# EAGLE schematic SSS_SOB_REPRO (EAGLE 9.6.2)
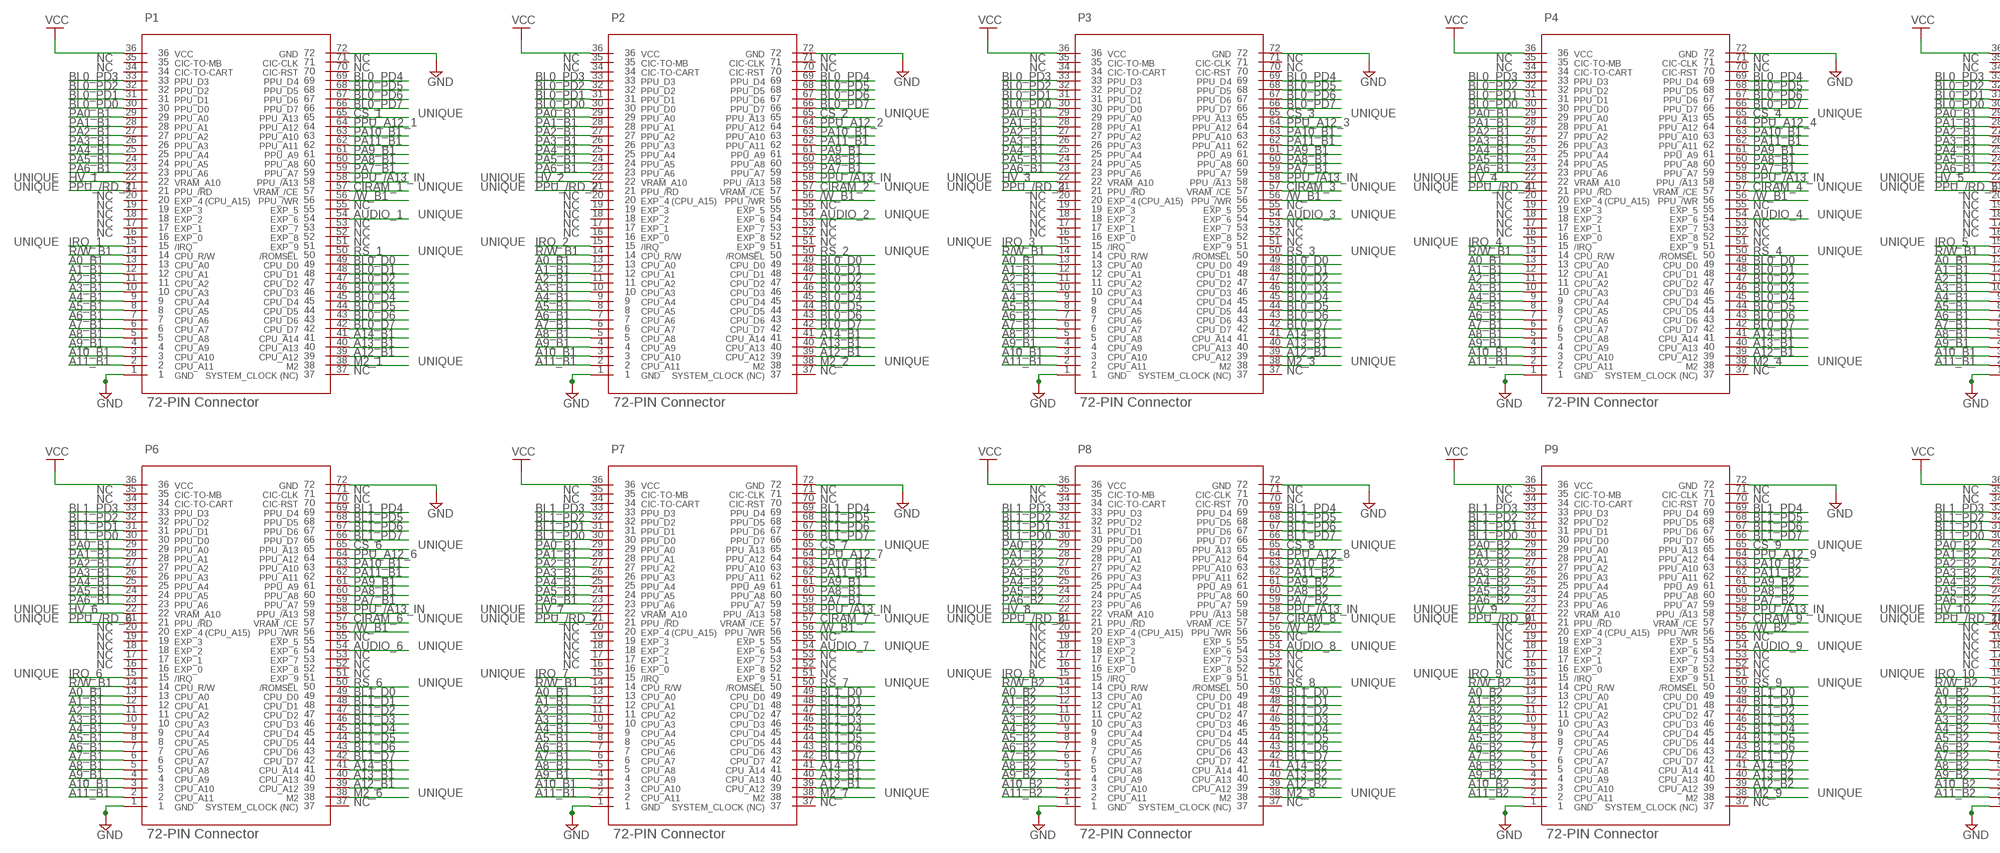
[diagram p0: schematic, sheet 1, part 1 of 3]
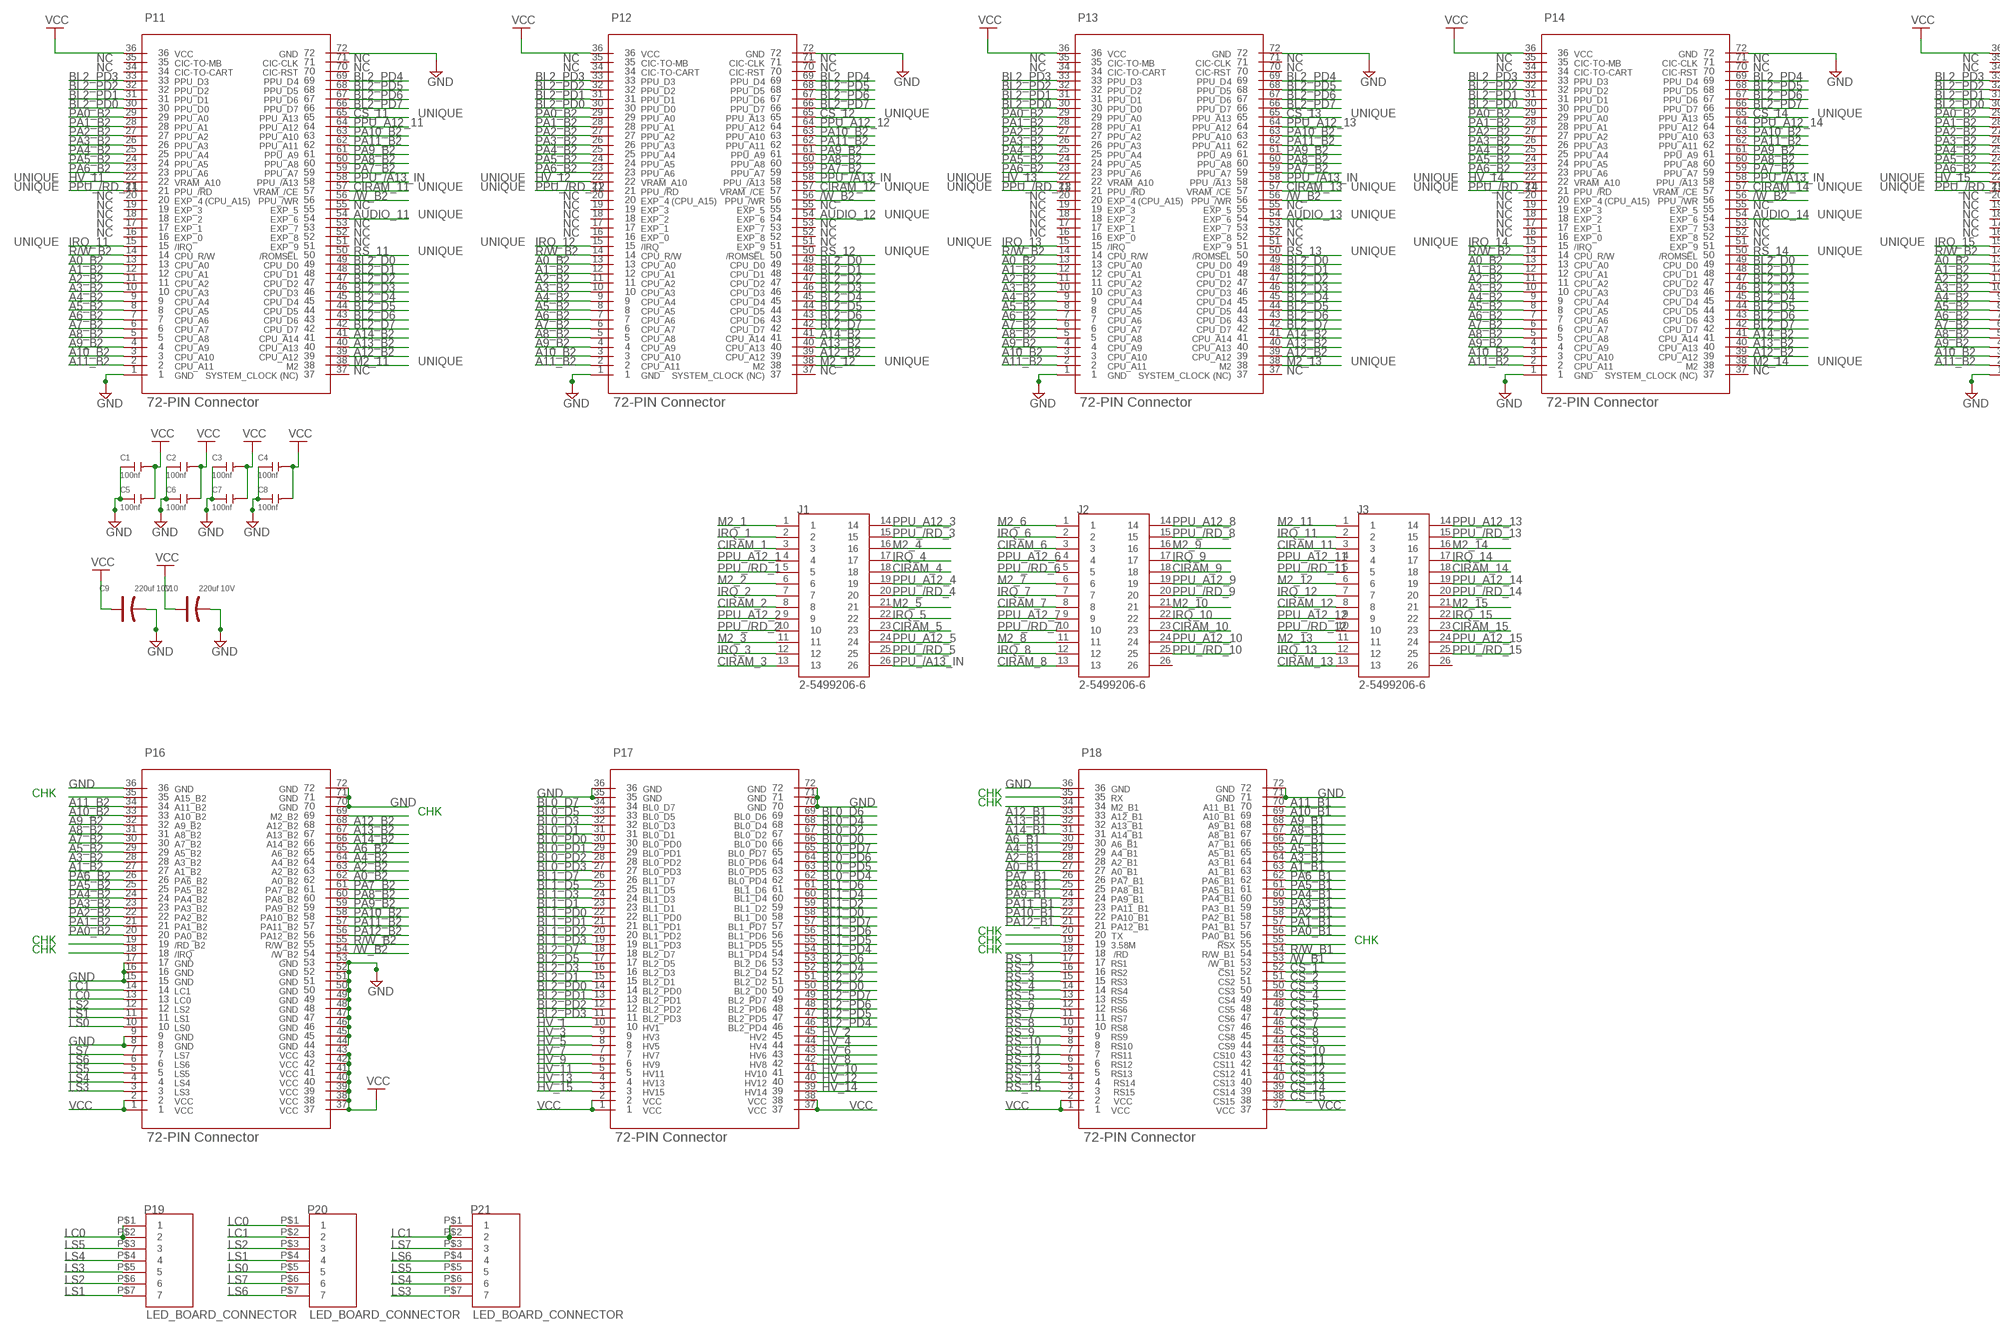
[diagram p1: schematic, sheet 1, part 2 of 3]
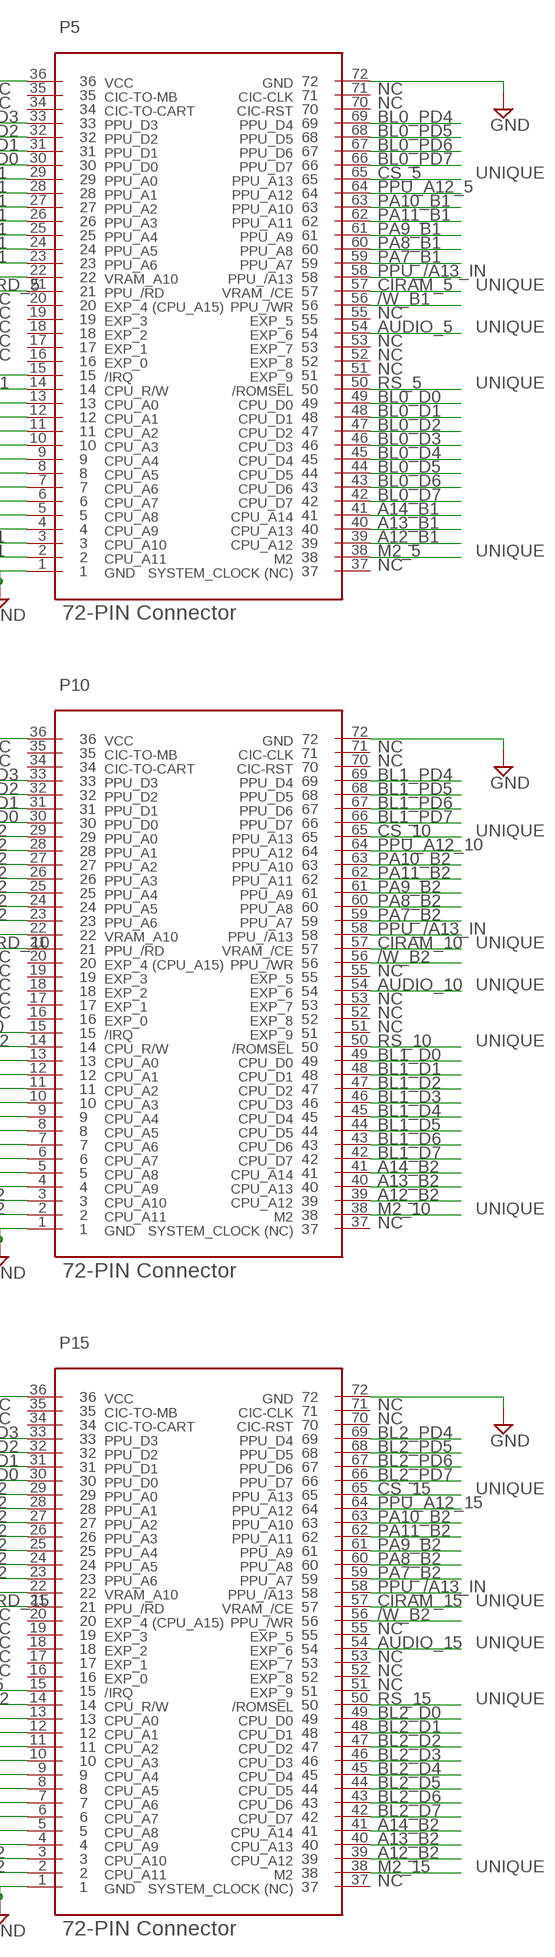
[diagram p2: schematic, sheet 1, part 3 of 3]

## Parts
C1  100nf  CERAMIC-100NF-50V-10%-X7R(0603)  [C0603]
C2  100nf  CERAMIC-100NF-50V-10%-X7R(0603)  [C0603]
C3  100nf  CERAMIC-100NF-50V-10%-X7R(0603)  [C0603]
C4  100nf  CERAMIC-100NF-50V-10%-X7R(0603)  [C0603]
C5  100nf  CERAMIC-100NF-50V-10%-X7R(0603)  [C0603]
C6  100nf  CERAMIC-100NF-50V-10%-X7R(0603)  [C0603]
C7  100nf  CERAMIC-100NF-50V-10%-X7R(0603)  [C0603]
C8  100nf  CERAMIC-100NF-50V-10%-X7R(0603)  [C0603]
C9  220uf 10V  DIP-ALUMINUM-100UF-16V(D5-H7MM)  [PC-D5.3MM]
C10  220uf 10V  DIP-ALUMINUM-100UF-16V(D5-H7MM)  [PC-D5.3MM]
J1  2-5499206-6  [TE_2-5499206-6]
J2  2-5499206-6  [TE_2-5499206-6]
J3  2-5499206-6  [TE_2-5499206-6]
P1  CARTRIDGE_CONNECTOR  [72PIN]
P2  CARTRIDGE_CONNECTOR  [72PIN]
P3  CARTRIDGE_CONNECTOR  [72PIN]
P4  CARTRIDGE_CONNECTOR  [72PIN]
P5  CARTRIDGE_CONNECTOR  [72PIN]
P6  CARTRIDGE_CONNECTOR  [72PIN]
P7  CARTRIDGE_CONNECTOR  [72PIN]
P8  CARTRIDGE_CONNECTOR  [72PIN]
P9  CARTRIDGE_CONNECTOR  [72PIN]
P10  CARTRIDGE_CONNECTOR  [72PIN]
P11  CARTRIDGE_CONNECTOR  [72PIN]
P12  CARTRIDGE_CONNECTOR  [72PIN]
P13  CARTRIDGE_CONNECTOR  [72PIN]
P14  CARTRIDGE_CONNECTOR  [72PIN]
P15  CARTRIDGE_CONNECTOR  [72PIN]
P16  P16_CONNECTOR  [72PIN]
P17  P17_CONNECTOR  [72PIN]
P18  P18_CONNECTOR  [72PIN]
P19  LED_BOARD_CONNECTOR  [7PIN_LED]
P20  LED_BOARD_CONNECTOR  [7PIN_LED]
P21  LED_BOARD_CONNECTOR  [7PIN_LED]

## Nets
/RD_B2: P16.19
/W_B1: P1.56 P2.56 P3.56 P4.56 P5.56 P6.56 P7.56 P18.53
/W_B2: P8.56 P9.56 P10.56 P11.56 P12.56 P13.56 P14.56 P15.56 P16.54
A0_B1: P1.13 P2.13 P3.13 P4.13 P5.13 P6.13 P7.13 P18.27
A0_B2: P8.13 P9.13 P10.13 P11.13 P12.13 P13.13 P14.13 P15.13 P16.62
A1_B1: P1.12 P2.12 P3.12 P4.12 P5.12 P6.12 P7.12 P18.63
A1_B2: P8.12 P9.12 P10.12 P11.12 P12.12 P13.12 P14.12 P15.12 P16.27
A2_B1: P1.11 P2.11 P3.11 P4.11 P5.11 P6.11 P7.11 P18.28
A2_B2: P8.11 P9.11 P10.11 P11.11 P12.11 P13.11 P14.11 P15.11 P16.63
A3_B1: P1.10 P2.10 P3.10 P4.10 P5.10 P6.10 P7.10 P18.64
A3_B2: P8.10 P9.10 P10.10 P11.10 P12.10 P13.10 P14.10 P15.10 P16.28
A4_B1: P1.9 P2.9 P3.9 P4.9 P5.9 P6.9 P7.9 P18.29
A4_B2: P8.9 P9.9 P10.9 P11.9 P12.9 P13.9 P14.9 P15.9 P16.64
A5_B1: P1.8 P2.8 P3.8 P4.8 P5.8 P6.8 P7.8 P18.65
A5_B2: P8.8 P9.8 P10.8 P11.8 P12.8 P13.8 P14.8 P15.8 P16.29
A6_B1: P1.7 P2.7 P3.7 P4.7 P5.7 P6.7 P7.7 P18.30
A6_B2: P8.7 P9.7 P10.7 P11.7 P12.7 P13.7 P14.7 P15.7 P16.65
A7_B1: P1.6 P2.6 P3.6 P4.6 P5.6 P6.6 P7.6 P18.66
A7_B2: P8.6 P9.6 P10.6 P11.6 P12.6 P13.6 P14.6 P15.6 P16.30
A8_B1: P1.5 P2.5 P3.5 P4.5 P5.5 P6.5 P7.5 P18.67
A8_B2: P8.5 P9.5 P10.5 P11.5 P12.5 P13.5 P14.5 P15.5 P16.31
A9_B1: P1.4 P2.4 P3.4 P4.4 P5.4 P6.4 P7.4 P18.68
A9_B2: P8.4 P9.4 P10.4 P11.4 P12.4 P13.4 P14.4 P15.4 P16.32
A10_B1: P1.3 P2.3 P3.3 P4.3 P5.3 P6.3 P7.3 P18.69
A10_B2: P8.3 P9.3 P10.3 P11.3 P12.3 P13.3 P14.3 P15.3 P16.33
A11_B1: P1.2 P2.2 P3.2 P4.2 P5.2 P6.2 P7.2 P18.70
A11_B2: P8.2 P9.2 P10.2 P11.2 P12.2 P13.2 P14.2 P15.2 P16.34
A12_B1: P1.39 P2.39 P3.39 P4.39 P5.39 P6.39 P7.39 P18.33
A12_B2: P8.39 P9.39 P10.39 P11.39 P12.39 P13.39 P14.39 P15.39 P16.68
A13_B1: P1.40 P2.40 P3.40 P4.40 P5.40 P6.40 P7.40 P18.32
A13_B2: P8.40 P9.40 P10.40 P11.40 P12.40 P13.40 P14.40 P15.40 P16.67
A14_B1: P1.41 P2.41 P3.41 P4.41 P5.41 P6.41 P7.41 P18.31
A14_B2: P8.41 P9.41 P10.41 P11.41 P12.41 P13.41 P14.41 P15.41 P16.66
A15_B2: P16.35
AUDIO_1: P1.54
AUDIO_2: P2.54
AUDIO_3: P3.54
AUDIO_4: P4.54
AUDIO_5: P5.54
AUDIO_6: P6.54
AUDIO_7: P7.54
AUDIO_8: P8.54
AUDIO_9: P9.54
AUDIO_10: P10.54
AUDIO_11: P11.54
AUDIO_12: P12.54
AUDIO_13: P13.54
AUDIO_14: P14.54
AUDIO_15: P15.54
BL0_D0: P1.49 P2.49 P3.49 P4.49 P5.49 P17.66
BL0_D1: P1.48 P2.48 P3.48 P4.48 P5.48 P17.31
BL0_D2: P1.47 P2.47 P3.47 P4.47 P5.47 P17.67
BL0_D3: P1.46 P2.46 P3.46 P4.46 P5.46 P17.32
BL0_D4: P1.45 P2.45 P3.45 P4.45 P5.45 P17.68
BL0_D5: P1.44 P2.44 P3.44 P4.44 P5.44 P17.33
BL0_D6: P1.43 P2.43 P3.43 P4.43 P5.43 P17.69
BL0_D7: P1.42 P2.42 P3.42 P4.42 P5.42 P17.34
BL0_PD0: P1.30 P2.30 P3.30 P4.30 P5.30 P17.30
BL0_PD1: P1.31 P2.31 P3.31 P4.31 P5.31 P17.29
BL0_PD2: P1.32 P2.32 P3.32 P4.32 P5.32 P17.28
BL0_PD3: P1.33 P2.33 P3.33 P4.33 P5.33 P17.27
BL0_PD4: P1.69 P2.69 P3.69 P4.69 P5.69 P17.62
BL0_PD5: P1.68 P2.68 P3.68 P4.68 P5.68 P17.63
BL0_PD6: P1.67 P2.67 P3.67 P4.67 P5.67 P17.64
BL0_PD7: P1.66 P2.66 P3.66 P4.66 P5.66 P17.65
BL1_D0: P6.49 P7.49 P8.49 P9.49 P10.49 P17.58
BL1_D1: P6.48 P7.48 P8.48 P9.48 P10.48 P17.23
BL1_D2: P6.47 P7.47 P8.47 P9.47 P10.47 P17.59
BL1_D3: P6.46 P7.46 P8.46 P9.46 P10.46 P17.24
BL1_D4: P6.45 P7.45 P8.45 P9.45 P10.45 P17.60
BL1_D5: P6.44 P7.44 P8.44 P9.44 P10.44 P17.25
BL1_D6: P6.43 P7.43 P8.43 P9.43 P10.43 P17.61
BL1_D7: P6.42 P7.42 P8.42 P9.42 P10.42 P17.26
BL1_PD0: P6.30 P7.30 P8.30 P9.30 P10.30 P17.22
BL1_PD1: P6.31 P7.31 P8.31 P9.31 P10.31 P17.21
BL1_PD2: P6.32 P7.32 P8.32 P9.32 P10.32 P17.20
BL1_PD3: P6.33 P7.33 P8.33 P9.33 P10.33 P17.19
BL1_PD4: P6.69 P7.69 P8.69 P9.69 P10.69 P17.54
BL1_PD5: P6.68 P7.68 P8.68 P9.68 P10.68 P17.55
BL1_PD6: P6.67 P7.67 P8.67 P9.67 P10.67 P17.56
BL1_PD7: P6.66 P7.66 P8.66 P9.66 P10.66 P17.57
BL2_D0: P11.49 P12.49 P13.49 P14.49 P15.49 P17.50
BL2_D1: P11.48 P12.48 P13.48 P14.48 P15.48 P17.15
BL2_D2: P11.47 P12.47 P13.47 P14.47 P15.47 P17.51
BL2_D3: P11.46 P12.46 P13.46 P14.46 P15.46 P17.16
BL2_D4: P11.45 P12.45 P13.45 P14.45 P15.45 P17.52
BL2_D5: P11.44 P12.44 P13.44 P14.44 P15.44 P17.17
BL2_D6: P11.43 P12.43 P13.43 P14.43 P15.43 P17.53
BL2_D7: P11.42 P12.42 P13.42 P14.42 P15.42 P17.18
BL2_PD0: P11.30 P12.30 P13.30 P14.30 P15.30 P17.14
BL2_PD1: P11.31 P12.31 P13.31 P14.31 P15.31 P17.13
BL2_PD2: P11.32 P12.32 P13.32 P14.32 P15.32 P17.12
BL2_PD3: P11.33 P12.33 P13.33 P14.33 P15.33 P17.11
BL2_PD4: P11.69 P12.69 P13.69 P14.69 P15.69 P17.46
BL2_PD5: P11.68 P12.68 P13.68 P14.68 P15.68 P17.47
BL2_PD6: P11.67 P12.67 P13.67 P14.67 P15.67 P17.48
BL2_PD7: P11.66 P12.66 P13.66 P14.66 P15.66 P17.49
CIRAM_1: J1.3 P1.57
CIRAM_2: J1.8 P2.57
CIRAM_3: J1.13 P3.57
CIRAM_4: J1.18 P4.57
CIRAM_5: J1.23 P5.57
CIRAM_6: J2.3 P6.57
CIRAM_7: J2.8 P7.57
CIRAM_8: J2.13 P8.57
CIRAM_9: J2.18 P9.57
CIRAM_10: J2.23 P10.57
CIRAM_11: J3.3 P11.57
CIRAM_12: J3.8 P12.57
CIRAM_13: J3.13 P13.57
CIRAM_14: J3.18 P14.57
CIRAM_15: J3.23 P15.57
CS_1: P1.65 P18.52
CS_2: P2.65 P18.51
CS_3: P3.65 P18.50
CS_4: P4.65 P18.49
CS_5: P5.65 P18.48
CS_6: P6.65 P18.47
CS_7: P7.65 P18.46
CS_8: P8.65 P18.45
CS_9: P9.65 P18.44
CS_10: P10.65 P18.43
CS_11: P11.65 P18.42
CS_12: P12.65 P18.41
CS_13: P13.65 P18.40
CS_14: P14.65 P18.39
CS_15: P15.65 P18.38
GND: C1.1 C2.1 C3.1 C4.1 C5.1 C6.1 C7.1 C8.1 C9.- C10.- P1.1 P1.72 P2.1 P2.72 P3.1 P3.72 P4.1 P4.72 P5.1 P5.72 P6.1 P6.72 P7.1 P7.72 P8.1 P8.72 P9.1 P9.72 P10.1 P10.72 P11.1 P11.72 P12.1 P12.72 P13.1 P13.72 P14.1 P14.72 P15.1 P15.72 P16.8 P16.9 P16.15 P16.16 P16.17 P16.36 P16.44 P16.45 P16.46 P16.47 P16.48 P16.49 P16.50 P16.51 P16.52 P16.53 P16.70 P16.71 P16.72 P17.35 P17.36 P17.70 P17.71 P17.72 P18.36 P18.71 P18.72
HV_1: P1.22 P17.10
HV_2: P2.22 P17.45
HV_3: P3.22 P17.9
HV_4: P4.22 P17.44
HV_5: P5.22 P17.8
HV_6: P6.22 P17.43
HV_7: P7.22 P17.7
HV_8: P8.22 P17.42
HV_9: P9.22 P17.6
HV_10: P10.22 P17.41
HV_11: P11.22 P17.5
HV_12: P12.22 P17.40
HV_13: P13.22 P17.4
HV_14: P14.22 P17.39
HV_15: P15.22 P17.3
IRQ_1: J1.2 P1.15
IRQ_2: J1.7 P2.15
IRQ_3: J1.12 P3.15
IRQ_4: J1.17 P4.15
IRQ_5: J1.22 P5.15
IRQ_6: J2.2 P6.15
IRQ_7: J2.7 P7.15
IRQ_8: J2.12 P8.15
IRQ_9: J2.17 P9.15
IRQ_10: J2.22 P10.15
IRQ_11: J3.2 P11.15
IRQ_12: J3.7 P12.15
IRQ_13: J3.12 P13.15
IRQ_14: J3.17 P14.15
IRQ_15: J3.22 P15.15
LC0: P16.13 P19.P$1 P19.P$2 P20.P$1
LC1: P16.14 P20.P$2 P21.P$1 P21.P$2
LS0: P16.10 P20.P$5
LS1: P16.11 P19.P$7 P20.P$4
LS2: P16.12 P19.P$6 P20.P$3
LS3: P16.3 P19.P$5 P21.P$7
LS4: P16.4 P19.P$4 P21.P$6
LS5: P16.5 P19.P$3 P21.P$5
LS6: P16.6 P20.P$7 P21.P$4
LS7: P16.7 P20.P$6 P21.P$3
M2_1: J1.1 P1.38
M2_2: J1.6 P2.38
M2_3: J1.11 P3.38
M2_4: J1.16 P4.38
M2_5: J1.21 P5.38
M2_6: J2.1 P6.38
M2_7: J2.6 P7.38
M2_8: J2.11 P8.38
M2_9: J2.16 P9.38
M2_10: J2.21 P10.38
M2_11: J3.1 P11.38
M2_12: J3.6 P12.38
M2_13: J3.11 P13.38
M2_14: J3.16 P14.38
M2_15: J3.21 P15.38
N$19: P16.18
N$30: P16.69
N$113: P18.35
N$114: P18.34
N$128: P18.20
N$129: P18.19
N$130: P18.18
N$169: P18.55
PA0_B1: P1.29 P2.29 P3.29 P4.29 P5.29 P6.29 P7.29 P18.56
PA0_B2: P8.29 P9.29 P10.29 P11.29 P12.29 P13.29 P14.29 P15.29 P16.20
PA1_B1: P1.28 P2.28 P3.28 P4.28 P5.28 P6.28 P7.28 P18.57
PA1_B2: P8.28 P9.28 P10.28 P11.28 P12.28 P13.28 P14.28 P15.28 P16.21
PA2_B1: P1.27 P2.27 P3.27 P4.27 P5.27 P6.27 P7.27 P18.58
PA2_B2: P8.27 P9.27 P10.27 P11.27 P12.27 P13.27 P14.27 P15.27 P16.22
PA3_B1: P1.26 P2.26 P3.26 P4.26 P5.26 P6.26 P7.26 P18.59
PA3_B2: P8.26 P9.26 P10.26 P11.26 P12.26 P13.26 P14.26 P15.26 P16.23
PA4_B1: P1.25 P2.25 P3.25 P4.25 P5.25 P6.25 P7.25 P18.60
PA4_B2: P8.25 P9.25 P10.25 P11.25 P12.25 P13.25 P14.25 P15.25 P16.24
PA5_B1: P1.24 P2.24 P3.24 P4.24 P5.24 P6.24 P7.24 P18.61
PA5_B2: P8.24 P9.24 P10.24 P11.24 P12.24 P13.24 P14.24 P15.24 P16.25
PA6_B1: P1.23 P2.23 P3.23 P4.23 P5.23 P6.23 P7.23 P18.62
PA6_B2: P8.23 P9.23 P10.23 P11.23 P12.23 P13.23 P14.23 P15.23 P16.26
PA7_B1: P1.59 P2.59 P3.59 P4.59 P5.59 P6.59 P7.59 P18.26
PA7_B2: P8.59 P9.59 P10.59 P11.59 P12.59 P13.59 P14.59 P15.59 P16.61
PA8_B1: P1.60 P2.60 P3.60 P4.60 P5.60 P6.60 P7.60 P18.25
PA8_B2: P8.60 P9.60 P10.60 P11.60 P12.60 P13.60 P14.60 P15.60 P16.60
PA9_B1: P1.61 P2.61 P3.61 P4.61 P5.61 P6.61 P7.61 P18.24
PA9_B2: P8.61 P9.61 P10.61 P11.61 P12.61 P13.61 P14.61 P15.61 P16.59
PA10_B1: P1.63 P2.63 P3.63 P4.63 P5.63 P6.63 P7.63 P18.22
PA10_B2: P8.63 P9.63 P10.63 P11.63 P12.63 P13.63 P14.63 P15.63 P16.58
PA11_B1: P1.62 P2.62 P3.62 P4.62 P5.62 P6.62 P7.62 P18.23
PA11_B2: P8.62 P9.62 P10.62 P11.62 P12.62 P13.62 P14.62 P15.62 P16.57
PA12_B1: P18.21
PA12_B2: P16.56
PPU_/A13_IN: J1.26 P1.58 P2.58 P3.58 P4.58 P5.58 P6.58 P7.58 P8.58 P9.58 P10.58 P11.58 P12.58 P13.58 P14.58 P15.58
PPU_/RD_1: J1.5 P1.21
PPU_/RD_2: J1.10 P2.21
PPU_/RD_3: J1.15 P3.21
PPU_/RD_4: J1.20 P4.21
PPU_/RD_5: J1.25 P5.21
PPU_/RD_6: J2.5 P6.21
PPU_/RD_7: J2.10 P7.21
PPU_/RD_8: J2.15 P8.21
PPU_/RD_9: J2.20 P9.21
PPU_/RD_10: J2.25 P10.21
PPU_/RD_11: J3.5 P11.21
PPU_/RD_12: J3.10 P12.21
PPU_/RD_13: J3.15 P13.21
PPU_/RD_14: J3.20 P14.21
PPU_/RD_15: J3.25 P15.21
PPU_A12_1: J1.4 P1.64
PPU_A12_2: J1.9 P2.64
PPU_A12_3: J1.14 P3.64
PPU_A12_4: J1.19 P4.64
PPU_A12_5: J1.24 P5.64
PPU_A12_6: J2.4 P6.64
PPU_A12_7: J2.9 P7.64
PPU_A12_8: J2.14 P8.64
PPU_A12_9: J2.19 P9.64
PPU_A12_10: J2.24 P10.64
PPU_A12_11: J3.4 P11.64
PPU_A12_12: J3.9 P12.64
PPU_A12_13: J3.14 P13.64
PPU_A12_14: J3.19 P14.64
PPU_A12_15: J3.24 P15.64
R/W_B1: P1.14 P2.14 P3.14 P4.14 P5.14 P6.14 P7.14 P18.54
R/W_B2: P8.14 P9.14 P10.14 P11.14 P12.14 P13.14 P14.14 P15.14 P16.55
RS_1: P1.50 P18.17
RS_2: P2.50 P18.16
RS_3: P3.50 P18.15
RS_4: P4.50 P18.14
RS_5: P5.50 P18.13
RS_6: P6.50 P18.12
RS_7: P7.50 P18.11
RS_8: P8.50 P18.10
RS_9: P9.50 P18.9
RS_10: P10.50 P18.8
RS_11: P11.50 P18.7
RS_12: P12.50 P18.6
RS_13: P13.50 P18.5
RS_14: P14.50 P18.4
RS_15: P15.50 P18.3
VCC: C1.2 C2.2 C3.2 C4.2 C5.2 C6.2 C7.2 C8.2 C9.+ C10.+ P1.36 P2.36 P3.36 P4.36 P5.36 P6.36 P7.36 P8.36 P9.36 P10.36 P11.36 P12.36 P13.36 P14.36 P15.36 P16.1 P16.2 P16.37 P16.38 P16.39 P16.40 P16.41 P16.42 P16.43 P17.1 P17.2 P17.37 P17.38 P18.1 P18.2 P18.37
Unconnected: J2.26 J3.26 P1.16 P1.17 P1.18 P1.19 P1.20 P1.34 P1.35 P1.37 P1.51 P1.52 P1.53 P1.55 P1.70 P1.71 P2.16 P2.17 P2.18 P2.19 P2.20 P2.34 P2.35 P2.37 P2.51 P2.52 P2.53 P2.55 P2.70 P2.71 P3.16 P3.17 P3.18 P3.19 P3.20 P3.34 P3.35 P3.37 P3.51 P3.52 P3.53 P3.55 P3.70 P3.71 P4.16 P4.17 P4.18 P4.19 P4.20 P4.34 P4.35 P4.37 P4.51 P4.52 P4.53 P4.55 P4.70 P4.71 P5.16 P5.17 P5.18 P5.19 P5.20 P5.34 P5.35 P5.37 P5.51 P5.52 P5.53 P5.55 P5.70 P5.71 P6.16 P6.17 P6.18 P6.19 P6.20 P6.34 P6.35 P6.37 P6.51 P6.52 P6.53 P6.55 P6.70 P6.71 P7.16 P7.17 P7.18 P7.19 P7.20 P7.34 P7.35 P7.37 P7.51 P7.52 P7.53 P7.55 P7.70 P7.71 P8.16 P8.17 P8.18 P8.19 P8.20 P8.34 P8.35 P8.37 P8.51 P8.52 P8.53 P8.55 P8.70 P8.71 P9.16 P9.17 P9.18 P9.19 P9.20 P9.34 P9.35 P9.37 P9.51 P9.52 P9.53 P9.55 P9.70 P9.71 P10.16 P10.17 P10.18 P10.19 P10.20 P10.34 P10.35 P10.37 P10.51 P10.52 P10.53 P10.55 P10.70 P10.71 P11.16 P11.17 P11.18 P11.19 P11.20 P11.34 P11.35 P11.37 P11.51 P11.52 P11.53 P11.55 P11.70 P11.71 P12.16 P12.17 P12.18 P12.19 P12.20 P12.34 P12.35 P12.37 P12.51 P12.52 P12.53 P12.55 P12.70 P12.71 P13.16 P13.17 P13.18 P13.19 P13.20 P13.34 P13.35 P13.37 P13.51 P13.52 P13.53 P13.55 P13.70 P13.71 P14.16 P14.17 P14.18 P14.19 P14.20 P14.34 P14.35 P14.37 P14.51 P14.52 P14.53 P14.55 P14.70 P14.71 P15.16 P15.17 P15.18 P15.19 P15.20 P15.34 P15.35 P15.37 P15.51 P15.52 P15.53 P15.55 P15.70 P15.71

## Notes on the sheet
- NC | NC | NC | NC | NC | NC | NC | NC | NC | NC
- NC | NC | NC | NC | NC | NC | NC | NC | NC | NC
- UNIQUE | UNIQUE | UNIQUE | UNIQUE | UNIQUE
- UNIQUE | UNIQUE | UNIQUE | UNIQUE | UNIQUE
- UNIQUE | UNIQUE | UNIQUE | UNIQUE | UNIQUE | UNIQUE | UNIQUE | UNIQUE | UNIQUE | UNIQUE
- NC | NC | NC | NC | NC
- NC | NC | NC | NC | NC | NC | NC | NC | NC | NC
- NC | UNIQUE | NC | UNIQUE | NC | UNIQUE | NC | UNIQUE | NC | UNIQUE
- NC | NC | NC | NC | NC | NC | NC | NC | NC | NC
- NC | NC | NC | NC | NC | NC | NC | NC | NC | NC
- UNIQUE | NC | UNIQUE | NC | UNIQUE | NC | UNIQUE | NC | UNIQUE | NC
- UNIQUE | UNIQUE | UNIQUE | UNIQUE | UNIQUE
- UNIQUE | UNIQUE | UNIQUE | UNIQUE | UNIQUE
- NC | NC | NC | NC | NC
- NC | NC | NC | NC | NC | NC | NC | NC | NC | NC
- NC | NC | NC | NC | NC | NC | NC | NC | NC | NC
- UNIQUE | UNIQUE | UNIQUE | UNIQUE | UNIQUE
- UNIQUE | UNIQUE | UNIQUE | UNIQUE | UNIQUE
- UNIQUE | UNIQUE | UNIQUE | UNIQUE | UNIQUE | UNIQUE | UNIQUE | UNIQUE | UNIQUE | UNIQUE
- NC | NC | NC | NC | NC
- NC | NC | NC | NC | NC | NC | NC | NC | NC | NC
- NC | UNIQUE | NC | UNIQUE | NC | UNIQUE | NC | UNIQUE | NC | UNIQUE
- NC | NC | NC | NC | NC | NC | NC | NC | NC | NC
- NC | NC | NC | NC | NC | NC | NC | NC | NC | NC
- UNIQUE | NC | UNIQUE | NC | UNIQUE | NC | UNIQUE | NC | UNIQUE | NC
- UNIQUE | UNIQUE | UNIQUE | UNIQUE | UNIQUE
- UNIQUE | UNIQUE | UNIQUE | UNIQUE | UNIQUE
- NC | NC | NC | NC | NC
- NC | NC | NC | NC | NC | NC | NC | NC | NC | NC
- NC | NC | NC | NC | NC | NC | NC | NC | NC | NC
- UNIQUE | UNIQUE | UNIQUE | UNIQUE | UNIQUE
- UNIQUE | UNIQUE | UNIQUE | UNIQUE | UNIQUE
- UNIQUE | UNIQUE | UNIQUE | UNIQUE | UNIQUE | UNIQUE | UNIQUE | UNIQUE | UNIQUE | UNIQUE
- NC | NC | NC | NC | NC
- NC | NC | NC | NC | NC | NC | NC | NC | NC | NC
- NC | UNIQUE | NC | UNIQUE | NC | UNIQUE | NC | UNIQUE | NC | UNIQUE
- NC | NC | NC | NC | NC | NC | NC | NC | NC | NC
- NC | NC | NC | NC | NC | NC | NC | NC | NC | NC
- UNIQUE | NC | UNIQUE | NC | UNIQUE | NC | UNIQUE | NC | UNIQUE | NC
- UNIQUE | UNIQUE | UNIQUE | UNIQUE | UNIQUE
- UNIQUE | UNIQUE | UNIQUE | UNIQUE | UNIQUE
- NC | NC | NC | NC | NC
- CHK | CHK
- CHK
- CHK
- CHK
- CHK | CHK | CHK
- CHK | CHK

## Library data of the parts
C1-C8 = OPL_Capacitor:CERAMIC-100NF-50V-10%-X7R(0603): 302010138; MPN: CC0603KRX7R9BB104
C9 C10 = OPL_Capacitor:DIP-ALUMINUM-100UF-16V(D5-H7MM): 302030031; MPN: KS 100uF/16V; VALUE: 100uf
J1-J3 = 2-5499206-6:2-5499206-6: A/L UNIV HDR 26P VERT LG LAT BLUE Check prices <https://pricing.snapeda.com/parts/2-5499206-6/TE%20Connectivity/view-part?ref=eda>; AVAILABILITY: In Stock; CENTERLINE_PITCH: 2.54 mm[.1 in]; COMMENT: 2-5499206-6; DESCRIPTION: Conn Ejector Header HDR 26 POS 2.54mm Solder ST Thru-Hole; EU_ROHS_COMPLIANCE: Compliant; MF: TE Connectivity; MP: 2-5499206-6; NUMBER_OF_POSITIONS: 26; PACKAGE: None; PRICE: None; PRODUCT_TYPE: Connector; PURCHASE-URL: https://pricing.snapeda.com/search/part/2-5499206-6/?ref=eda
P1-P15 = SSS_SOB_REPRO:CARTRIDGE_CONNECTOR
P16 = SSS_SOB_REPRO:P16_CONNECTOR: P16_CONNECTOR
P17 = SSS_SOB_REPRO:P17_CONNECTOR
P18 = SSS_SOB_REPRO:P18_CONNECTOR
P19-P21 = SSS_SOB_REPRO:LED_BOARD_CONNECTOR